# Altium schematic sheet LED_debug.SchDoc
size A4
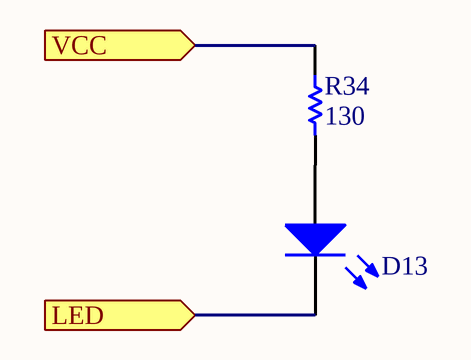
[diagram p0: LED_debug.SchDoc]

## Parts
D13  LED - NORMAL LED  [LED-0603 GREEN]  (value not drawn)
R34  value 130  [RS-0603]  (hidden comment: RS - RESISTOR)

## Ports
LED (in), VCC (in)

## Nets
LED: D13.K ; port LED
VCC: R34.1 ; port VCC
NetD13_A: D13.A R34.2

## Library data of the parts
R34 = RS - RESISTOR: POWER: RES POWER; TOLERANCE: RES TOL; Supplier Part Number 1: *; Supplier 1: *; (FIELD A): *; (FLIED C): *; (FIELD B): *; Manufacturer: *
D13 = LED - NORMAL LED: CURRENT: *; COLOR: *; FORWARS VOLTAGE: *; Supplier Part Number 1: *; Supplier 1: *; (FIELD B): *; (FIELD A): *; (FIELD C): *; Manufacturer: *